# Altium project BP.PrjPcb (part 2 of 2)

## Sheet BPPower Management.SchDoc
size A3; ApprovedBy: UDEMY; CheckedBy: Siz Değerli Öğrenciler; Revision: AA; SheetNumber: 3; SheetTotal: 5; PreparedBy: Mustafa Berk AYDOĞAN; ProjectDescription: Wireless Security
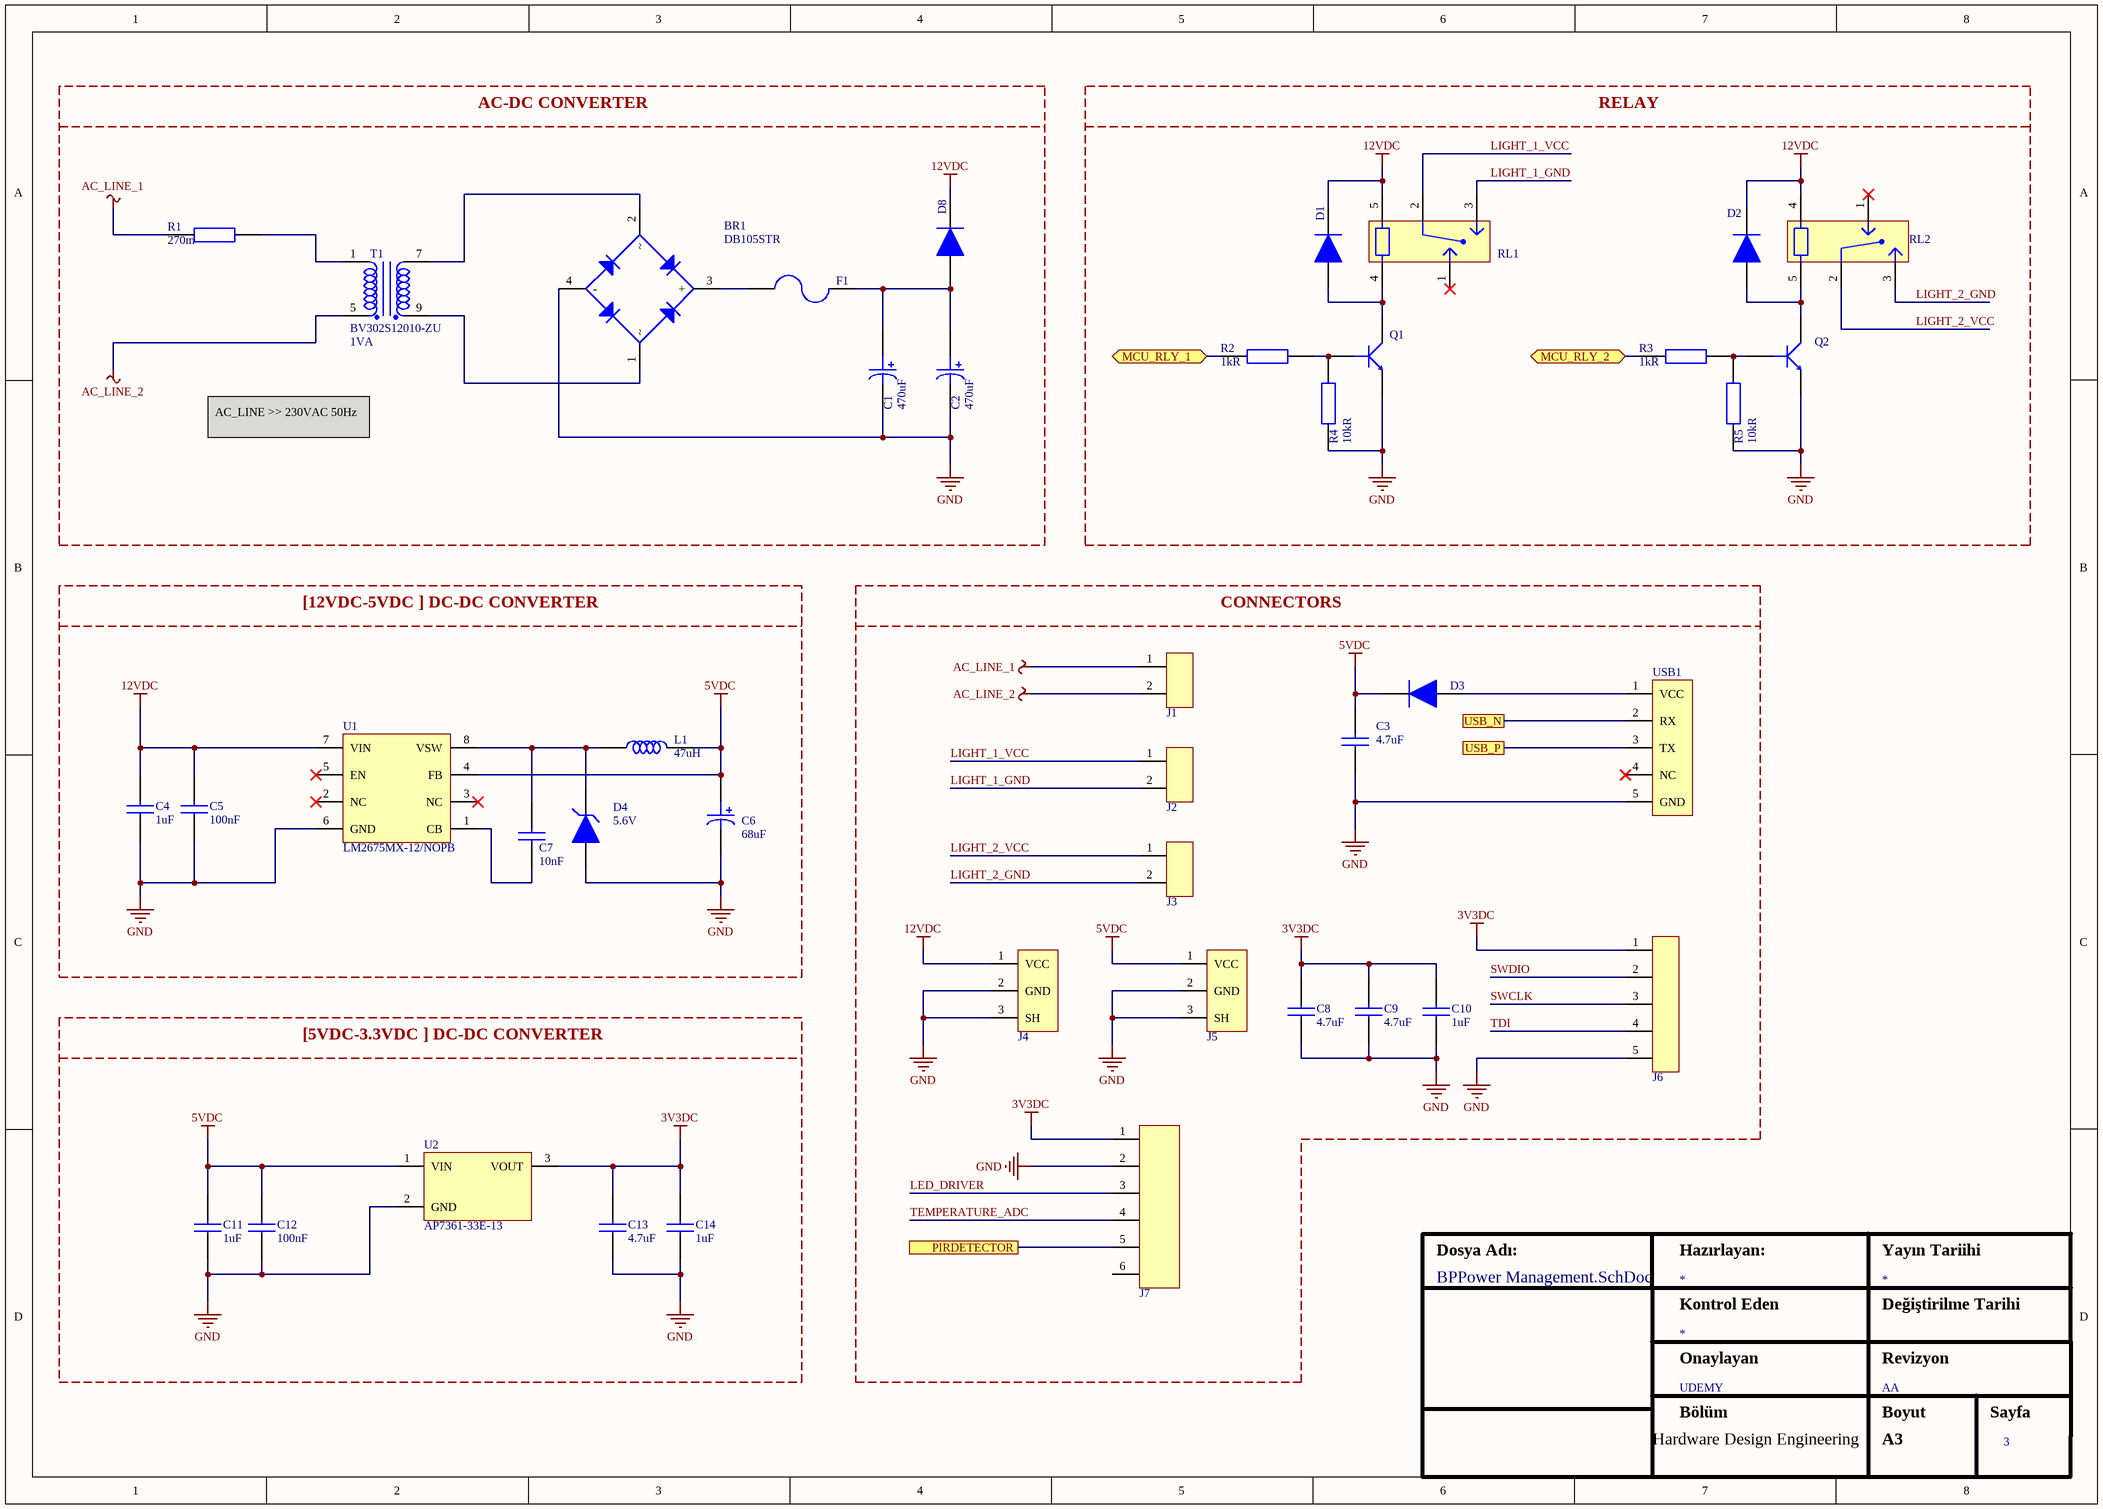
[diagram p1: BPPower Management.SchDoc]

### Parts
BR1  DB105STR  [DB105STR]
C1  Capacitance: 470uF  [CAP_RADIAL_D10_P5]  (hidden comment: ESH477M050AH4AA)
C2  Capacitance: 470uF  [CAP_RADIAL_D10_P5]  (hidden comment: ESH477M050AH4AA)
C3  Capacitance: 4.7uF  [CAP_0805]  (hidden comment: CL21A475KAQNNNE)
C4  Capacitance: 1uF  [CAP_0805]  (hidden comment: CL21B105KBFNNNE)
C5  Capacitance: 100nF  [CAP_0805]  (hidden comment: CL21B104KBCNNNC)
C6  Capacitance: 68uF  [CAP_EEVseries]  (hidden comment: EEV686M035A9HAA)
C7  Capacitance: 10nF  [CAP_0603]  (hidden comment: 0603B103K160CT)
C8  Capacitance: 4.7uF  [CAP_0805]  (hidden comment: CL21A475KAQNNNE)
C9  Capacitance: 4.7uF  [CAP_0805]  (hidden comment: CL21A475KAQNNNE)
C10  Capacitance: 1uF  [CAP_0805]  (hidden comment: CL21B105KBFNNNE)
C11  Capacitance: 1uF  [CAP_0805]  (hidden comment: CL21B105KBFNNNE)
C12  Capacitance: 100nF  [CAP_0603]  (hidden comment: C0603C104K5RACTU)
C13  Capacitance: 4.7uF  [CAP_0805]  (hidden comment: CL21A475KAQNNNE)
C14  Capacitance: 1uF  [CAP_0805]  (hidden comment: CL21B105KBFNNNE)
D1  1N4148WS  [SOD323F]  (value not drawn)
D2  1N4148WS  [SOD323F]  (value not drawn)
D3  1N4148WS  [SOD323F]  (value not drawn)
D4  Working Voltage: 5.6V  [SMB]  (hidden comment: 1SMB5919BT3G)
D8  1N4148WS  [SOD323F]  (value not drawn)
F1  3413.0216.22  [3413.0216.22]  (value not drawn)
J1  TBP01R1-508-02BE  [TBP01R1-508]  (value not drawn)
J2  TBP01R1-508-02BE  [TBP01R1-508]  (value not drawn)
J3  TBP01R1-508-02BE  [TBP01R1-508]  (value not drawn)
J4  PJ-037AH-SMT-TR  [JACK]  (value not drawn)
J5  PJ-037AH-SMT-TR  [JACK]  (value not drawn)
J6  SMH-105-02-L-S  [PINHEADER1X5_RA]  (value not drawn)
J7  64800611622  [64800611622]  (value not drawn)
L1  Inductance: 47uH  [IND_1212]  (hidden comment: 78438335470)
Q1  MMBT3904-7-F  [SOT-23F]  (value not drawn)
Q2  MMBT3904-7-F  [SOT-23F]  (value not drawn)
R1  Resistance: 270m  [RES_AXIAL_W]  (hidden comment: 5WD27)
R2  Resistance: 1kR  [RES_0603]  (hidden comment: RC0603FR-0710KL)
R3  Resistance: 1kR  [RES_0603]  (hidden comment: RC0603FR-0710KL)
R4  Resistance: 10kR  [RES_0603]  (hidden comment: RC0603FR-0710KL)
R5  Resistance: 10kR  [RES_0603]  (hidden comment: RC0603FR-0710KL)
RL1  ALQ112  [ALQ112]  (value not drawn)
RL2  ALQ112  [ALQ112]  (value not drawn)
T1  BV302S12010-ZU  Rated Power: 1VA  [BV302S]
U1  LM2675MX-12/NOPB  [SOIC8]
U2  AP7361-33E-13  [SOT223]
USB1  10118192-0001LF  [MICRO_B_USB]  (value not drawn)

### Blocks framed on the sheet
AC-DC CONVERTER: BR1 C1 C2 D8 F1 R1 T1
RELAY: D1 D2 Q1 Q2 R2-R5 RL1 RL2
[12VDC-5VDC ] DC-DC CONVERTER: C4-C7 D4 L1 U1
CONNECTORS: C3 C8-C10 D3 J1-J7 USB1
[5VDC-3.3VDC ] DC-DC CONVERTER: C11-C14 U2

### Ports
MCU_RLY_1 (bidir), MCU_RLY_2 (bidir), PIRDETECTOR, USB_N, USB_P

### Nets
3V3DC: C8.2 C9.2 C10.2 C13.2 C14.2 J6.1 J7.1 U2.3(VOUT)
5VDC: C3.2 C6.1 C11.2 C12.2 D3.1 J5.1(VCC) L1.2 U1.4(FB) U2.1(VIN)
12VDC: C4.2 C5.2 D1.1 D2.1 D8.1 J4.1(VCC) RL1.5 RL2.4 U1.7(VIN)
AC_LINE_1: J1.1 R1.1
AC_LINE_2: J1.2 T1.5
GND: BR1.4(-) C1.2 C2.2 C3.1 C4.1 C5.1 C6.2 C8.1 C9.1 C10.1 C11.1 C12.1 C13.1 C14.1 D4.A J4.2(GND) J4.3(SH) J5.2(GND) J5.3(SH) J6.5 J7.2 Q1.2(E) Q2.2(E) R4.1 R5.1 U1.6(GND) U2.2(GND) USB1.5(GND)
LED_DRIVER: J7.3
LIGHT_1_GND: J2.2 RL1.3
LIGHT_1_VCC: J2.1 RL1.2
LIGHT_2_GND: J3.2 RL2.3
LIGHT_2_VCC: J3.1 RL2.2
SWCLK: J6.3
SWDIO: J6.2
TDI: J6.4
TEMPERATURE_ADC: J7.4
NetBR1_1: BR1.1 T1.9
NetBR1_2: BR1.2 T1.7
NetBR1_3: BR1.3(+) F1.1
NetC1_1: C1.1 C2.1 D8.2 F1.2
NetC7_1: C7.1 U1.1(CB)
NetC7_2: C7.2 D4.C L1.1 U1.8(VSW)
NetD1_2: D1.2 Q1.3(C) RL1.4
NetD2_2: D2.2 Q2.3(C) RL2.5
NetD3_2: D3.2 USB1.1(VCC)
NetJ7_5: J7.5 ; port PIRDETECTOR
NetQ1_1: Q1.1(B) R2.2 R4.2
NetQ2_1: Q2.1(B) R3.2 R5.2
NetR1_2: R1.2 T1.1
NetR2_1: R2.1 ; port MCU_RLY_1
NetR3_1: R3.1 ; port MCU_RLY_2
NetUSB1_2: USB1.2(RX) ; port USB_N
NetUSB1_3: USB1.3(TX) ; port USB_P

Not connected (* = marked no-connect by the designer): J7 6; RL1 1*; RL2 1*; U1 2(NC)* 3(NC)* 5(EN)*; USB1 4(NC)*

### Notes on the sheet
- AC_LINE >> 230VAC 50Hz
- Dosya Adı:
- Hazırlayan:
- Yayın Tariihi
- Kontrol Eden
- Değiştirilme Tarihi
- Onaylayan
- Revizyon
- Hardware Design Engineering
- Bölüm
- Boyut
- A3
- Sayfa

### Library data of the parts
BR1 = DB105STR: Bridge Diode AC-DC; Manufacturer: Sangdest Microelectronics; Designed by: BERK; Max Current: 1A; Operating Voltage: 600V; Supplier 1: Digi-Key; Manufacturer Part Number: DB105STR; RoHS: No; Supplier Part Number 1: 1655-1821-1-ND
C1 C2 = CAP ALU ELEC 470uF 50V: CAP ALU ELEC 470uF 50V RADIAL; Manufacturer: KEMET; Designed by: BERK; Polarity: Polar; Tolerance: 20%; Life (Hours): 2000Hour; Supplier 1: Digi-Key; Manufacturer Part Number: ESH477M050AH4AA; RoHS: No; Stock 1: 1181; Pricing 1: 1=0,59000, 10=0,41700, 50=0,31540, 100=0,27470, 500=0,20350, 1000=0,17298, 2500=0,16280, 5000=0,15262 (USD); Mount: Through Hole; Case/Package: Radial; Min Operating Temperature: -40°C; Max Operating Temperature: 105°C; Packaging: Bulk; Voltage Rating: 50V; RoHS Compliant: No; ComponentLink1URL: https://api.kemet.com/component-edge/download/datasheet/ESH477M050AH4AA.pdf?src-supplier=Digi-Key; ComponentLink1Description: https://api.kemet.com/component-edge/download/datasheet/ESH477M050AH4AA.pdf?src-supplier=Digi-Key; Supplier Part Number 1: 399-15683-ND
C3 C8 C9 C13 = CAP CER 4.7uF 0805: CAP CER 4.7uF %10 0805; Manufacturer: Samsung; Tolerance: 10%; Voltage Rating: 25V; Dielectric: X5R; Designed by: BERK; Supplier 1: Digi-Key; Manufacturer Part Number: CL21A475KAQNNNE; RoHS: Yes; Category: Ceramic Capacitors; Stock 1: 1477018; Pricing 1: 1=0,11000, 10=0,08100, 50=0,04580, 100=0,03800, 500=0,02664, 1000=0,02205 (USD); Mount: Surface Mount; Case/Package: 0805; Case Code (Metric): 2012; Case Code (Imperial): 0805; Min Operating Temperature: -55°C; Max Operating Temperature: 85°C; Package Quantity: 1; Packaging: Tape and Reel; Voltage Rating (DC): 25V; Series: CL; Construction: Flat; Length: 2mm; Width: 0.049inch; Height: 1.25mm; Thickness: 0.055inch; Depth: 1.25mm; Radiation Hardening: No; Lead Free: Lead Free; RoHS Compliant: Yes; ComponentLink1URL: https://datasheet.ciiva.com/25798/cl21a475kaqnnne-25798882.pdf?src-supplier=Digi-Key; ComponentLink1Description: https://datasheet.ciiva.com/25798/cl21a475kaqnnne-25798882.pdf?src-supplier=Digi-Key; Supplier Part Number 1: 1276-1244-1-ND
C4 C10 C11 C14 = CAP CER 1uF 0805: CAP CER 1uF %10 0805; Manufacturer: Samsung; Designed by: BERK; Tolerance: 10%; Voltage Rating: 50V; Dielectric: X7R; Supplier 1: Digi-Key; Manufacturer Part Number: CL21B105KBFNNNE; RoHS: Yes; Category: Ceramic Capacitors; Stock 1: 958000; Pricing 1: 2000=0,02138, 4000=0,01956 (USD); Mount: Surface Mount; Case/Package: 0805; Case Code (Metric): 2012; Case Code (Imperial): 0805; Min Operating Temperature: -55°C; Max Operating Temperature: 125°C; Packaging: Tape and Reel; Package Quantity: 1; Voltage: 50V; Series: CL; Construction: Flat; Length: 2mm; Width: 0.049inch; Height: 1.25mm; Thickness: 0.053inch; Depth: 1.25mm; Radiation Hardening: No; RoHS Compliant: Yes; ComponentLink1URL: https://datasheet.ciiva.com/25800/cl21b105kbfnnne-25800291.pdf?src-supplier=Digi-Key; ComponentLink1Description: https://datasheet.ciiva.com/25800/cl21b105kbfnnne-25800291.pdf?src-supplier=Digi-Key; ComponentLink2URL: https://datasheet.ciiva.com/16449/cl21b105kbfnnne-16449003.pdf?src-supplier=Future+Electronics; ComponentLink2Description: https://datasheet.ciiva.com/16449/cl21b105kbfnnne-16449003.pdf?src-supplier=Future+Electronics; ComponentLink3URL: https://datasheet.ciiva.com/26838/getdatasheetpartid-354075-26838668.pdf?src-supplier=Verical; ComponentLink3Description: https://datasheet.ciiva.com/26838/getdatasheetpartid-354075-26838668.pdf?src-supplier=Verical; Supplier Part Number 1: 1276-1029-2-ND
C5 = CAP CER 100nF 0805: CAP CER 100nF %10 0805; Manufacturer: Samsung; Designed by: BERK; Material: Ceramic; Tolerance: 10%; Dielectric: X7R; Voltage Rating: 50V; Supplier 1: Digi-Key; Manufacturer Part Number: CL21B104KBCNNNC; RoHS: Yes; Category: Ceramic Capacitors; Stock 1: 3371502; Pricing 1: 1=0,10000, 10=0,04700, 50=0,02560, 100=0,02090, 500=0,01494, 1000=0,01174 (USD); Mount: Surface Mount; Case/Package: 0805; Case Code (Metric): 2012; Case Code (Imperial): 0805; Contact Plating: Tin; Min Operating Temperature: -55°C; Max Operating Temperature: 125°C; Packaging: Tape and Reel; Voltage: 50V; Voltage Rating (DC): 50V; Series: CL; Construction: Flat; Length: 2mm; Width: 0.049inch; Height: 0.85mm; Depth: 1.25mm; Thickness: 0.037inch; Radiation Hardening: No; Lead Free: Lead Free; RoHS Compliant: Yes; ComponentLink1URL: https://datasheet.ciiva.com/25710/cl21b104kbcnnnc-25710182.pdf?src-supplier=Digi-Key; ComponentLink1Description: https://datasheet.ciiva.com/25710/cl21b104kbcnnnc-25710182.pdf?src-supplier=Digi-Key; ComponentLink2URL: https://datasheet.ciiva.com/29199/454152-da-01-en-vs-kondensator-0805-29199814.pdf?src-supplier=Conrad; ComponentLink2Description: https://datasheet.ciiva.com/29199/454152-da-01-en-vs-kondensator-0805-29199814.pdf?src-supplier=Conrad; Supplier Part Number 1: 1276-1003-1-ND
C6 = CAP ALU 68uF: Cap Aluminum Lytic 68uF 35V 20% (6.3 X 7.7mm) SMD 280mA 2000h 105C T/R; Manufacturer: KEMET; Impedance: 340mR; Ripple Current: 196mA; Life (Hours): 2000Hour; Designator by: BERK; Supplier 1: Digi-Key; Manufacturer Part Number: EEV686M035A9HAA; RoHS: Yes; Category: Aluminum Electrolytic Capacitors; Stock 1: 543; Pricing 1: 1=0,54000, 10=0,38000, 50=0,28740, 100=0,25040, 500=0,18546 (USD); Mount: Surface Mount; Case/Package: Radial; Min Operating Temperature: -40°C; Max Operating Temperature: 105°C; Packaging: Tape and Reel; Package Quantity: 1; Voltage Rating: 35V; Tolerance: 20%; Voltage Rating (DC): 35V; Termination: SMD/SMT; Series: EEV; Length: 7.7mm; Height - Seated (Max): 0.315inch; RoHS Compliant: Yes; ComponentLink1URL: https://datasheet.ciiva.com/5365/kem-a4002-eev-535332-5365784.pdf?src-supplier=Mouser; ComponentLink1Description: https://datasheet.ciiva.com/5365/kem-a4002-eev-535332-5365784.pdf?src-supplier=Mouser; Supplier Part Number 1: 399-6722-1-ND
C7 = CAP CER 10nF 0603: CAP CER 10nF %10 0603; Manufacturer: Walsin Technologies; Designed by: BERK; Tolerance: 10%; Dielectric: X7R; Voltage Rating: 16V; Supplier 1: Digi-Key; Manufacturer Part Number: 0603B103K160CT; RoHS: Yes; Category: Ceramic Capacitors; Stock 1: 102474; Pricing 1: 1=0,10000, 10=0,03600, 50=0,01940, 100=0,01590, 500=0,01136, 1000=0,00892 (USD); Case/Package: 0603; Case Code (Metric): 1608; Case Code (Imperial): 0603; Min Operating Temperature: -55°C; Max Operating Temperature: 125°C; Packaging: Tape and Reel; Voltage Rating (DC): 16V; Length: 1.6mm; Depth: 0.8mm; REACH SVHC: Unknown; RoHS Compliant: Yes; ComponentLink1URL: http://www.farnell.com/datasheets/1958513.pdf?src-supplier=Farnell; ComponentLink1Description: http://www.farnell.com/datasheets/1958513.pdf?src-supplier=Farnell; ComponentLink2URL: http://components.arrow.com/part/dataview/0323_00656382?src-supplier=Arrow+Europe; ComponentLink2Description: http://components.arrow.com/part/dataview/0323_00656382?src-supplier=Arrow+Europe; ComponentLink3URL: http://www.farnell.com/datasheets/1958513.pdf?src-supplier=Element14; ComponentLink3Description: http://www.farnell.com/datasheets/1958513.pdf?src-supplier=Element14; ComponentLink4URL: http://www.passivecomponent.com/wp-content/uploads/2018/10/MLCC.pdf?src-supplier=Digi-Key; ComponentLink4Description: http://www.passivecomponent.com/wp-content/uploads/2018/10/MLCC.pdf?src-supplier=Digi-Key; Supplier Part Number 1: 1292-1384-1-ND
C12 = CAP CER 100nF 0603: CAP CER 100nF %10 0603 SMD; Manufacturer: KEMET; Designed by: BERK; Dielectric Material: Ceramic; Voltage Rating (DC): 50V; Tolerance: 10%; Dielectric: X7R; Dissipation Factor: 2.5%; Supplier 1: Digi-Key; Manufacturer Part Number: C0603C104K5RACTU; RoHS: Yes; Category: Ceramic Capacitors; Stock 1: 1666186; Pricing 1: 1=0,12000, 10=0,08500, 50=0,04620, 100=0,03770, 500=0,02696, 1000=0,02118 (USD); Mount: Surface Mount; Case/Package: 0603; Number of Pins: 2; Case Code (Metric): 1608; Case Code (Imperial): 0603; Contact Plating: Tin,Matte; Min Operating Temperature: -55°C; Max Operating Temperature: 125°C; Packaging: Tape and Reel; Package Quantity: 1; Termination: SMD/SMT; Voltage: 50V; Voltage Rating: 50V; Series: SMD Comm X7R; Length: 0.063inch; Width: 0.031inch; Height: 0.8mm; Thickness: 0.034inch; Lead Pitch: 0.7mm; Depth: 0.8mm; Radiation Hardening: No; RoHS Compliant: Yes; REACH SVHC: No SVHC; ComponentLink1URL: https://datasheet.ciiva.com/7823/kem-c1002-x7r-smd-7823591.pdf?src-supplier=Element14; ComponentLink1Description: https://datasheet.ciiva.com/7823/kem-c1002-x7r-smd-7823591.pdf?src-supplier=Element14; ComponentLink2URL: https://datasheet.ciiva.com/14602/70095383-14602583.pdf?src-supplier=Allied+Electronics; ComponentLink2Description: https://datasheet.ciiva.com/14602/70095383-14602583.pdf?src-supplier=Allied+Electronics; ComponentLink3URL: https://datasheet.ciiva.com/5999/kem-c1002-x7r-smd-5999400.pdf?src-supplier=Farnell; ComponentLink3Description: https://datasheet.ciiva.com/5999/kem-c1002-x7r-smd-5999400.pdf?src-supplier=Farnell; ComponentLink4URL: https://datasheet.ciiva.com/7823/kem-c1002-x7r-smd-7823592.pdf?src-supplier=Element14; ComponentLink4Description: https://datasheet.ciiva.com/7823/kem-c1002-x7r-smd-7823592.pdf?src-supplier=Element14; ComponentLink5URL: https://datasheet.ciiva.com/28645/1851736-28645640.pdf?src-supplier=Element14; ComponentLink5Description: https://datasheet.ciiva.com/28645/1851736-28645640.pdf?src-supplier=Element14; ComponentLink6URL: https://datasheet.ciiva.com/14585/70095383-14585209.pdf?src-supplier=Allied+Electronics; ComponentLink6Description: https://datasheet.ciiva.com/14585/70095383-14585209.pdf?src-supplier=Allied+Electronics; Supplier Part Number 1: 399-5089-1-ND
D1-D3 D8 = 1N4148WS: Diode, Single, 75 V, 150 mA, 1 V, 4 ns; Manufacturer: ON Semiconductor / Fairchild; Designed by: BERK; Forward Current: 150mA; Reverse Recovery Time: 4ns; Max Repetitive Reverse Voltage (Vrrm): 75V; Power Dissipation: 200mW; Max Reverse Current: 5uA; Forward Voltage: 1V; Max Forward Surge Current (Ifsm): 2A; Supplier 1: Digi-Key; Manufacturer Part Number: 1N4148WS; RoHS: Yes; Category: Rectifier Diodes; Stock 1: 79118; Pricing 1: 1=0,17000, 10=0,12100, 100=0,06530, 500=0,05128, 1000=0,03562 (USD); Mount: Surface Mount; Number of Pins: 2; Contact Plating: Tin,Matte; Weight: 0.0276g; Min Operating Temperature: -55°C; Max Operating Temperature: 150°C; Packaging: Tape and Reel; Package Quantity: 1; Recovery Time: 4ns; Average Rectified Current: 150mA; Element Configuration: Single; Reverse Voltage: 75V; Max Reverse Voltage (DC): 75V; Series: -; Length: 1.8mm; Width: 1.35mm; Height: 1mm; Radiation Hardening: No; REACH SVHC: No SVHC; Lead Free: Lead Free; RoHS Compliant: Yes; ComponentLink1URL: https://datasheet.ciiva.com/25968/1n914bws-25968945.pdf?src-supplier=Avnet+Europe; ComponentLink1Description: https://datasheet.ciiva.com/25968/1n914bws-25968945.pdf?src-supplier=Avnet+Europe; ComponentLink2URL: https://datasheet.ciiva.com/30479/0900766b810e1cd3-30479206.pdf?src-supplier=RSComponents; ComponentLink2Description: https://datasheet.ciiva.com/30479/0900766b810e1cd3-30479206.pdf?src-supplier=RSComponents; ComponentLink3URL: https://datasheet.ciiva.com/910/1n4148ws-910381.pdf?src-supplier=Digi-Key; ComponentLink3Description: https://datasheet.ciiva.com/910/1n4148ws-910381.pdf?src-supplier=Digi-Key; ComponentLink4URL: https://datasheet.ciiva.com/15208/getdatasheetpartid-127819-15208358.pdf?src-supplier=Verical; ComponentLink4Description: https://datasheet.ciiva.com/15208/getdatasheetpartid-127819-15208358.pdf?src-supplier=Verical; ComponentLink5URL: https://datasheet.ciiva.com/8300/1n914bws-8300360.pdf?src-supplier=Avnet; ComponentLink5Description: https://datasheet.ciiva.com/8300/1n914bws-8300360.pdf?src-supplier=Avnet; ComponentLink6URL: https://datasheet.ciiva.com/910/1n4148ws-910380.pdf?src-supplier=Digi-Key; ComponentLink6Description: https://datasheet.ciiva.com/910/1n4148ws-910380.pdf?src-supplier=Digi-Key; ComponentLink7URL: https://datasheet.ciiva.com/910/1n4148ws-910382.pdf?src-supplier=Digi-Key; ComponentLink7Description: https://datasheet.ciiva.com/910/1n4148ws-910382.pdf?src-supplier=Digi-Key; Supplier Part Number 1: 1N4148WSFSCT-ND
D4 = 1SMB5919BT3G: Diode Zener Single 5.6V 5% 3W 2-Pin SMB T/R; Manufacturer: ON Semiconductor; Designed by: BERK; Material: Plastic; Max Reverse Leakage Current: 5uA; Impedance: 2R; Forward Voltage: 1.5V; Power Dissipation: 550mW; Zener Current: 267mA; Test Current: 66.9mA; Breakdown Voltage: 5.88V; ESD Protection: Yes; Supplier 1: Digi-Key; Manufacturer Part Number: 1SMB5919BT3G; RoHS: Yes; Category: Zener Diodes; Pricing 1: 1=0,45000, 10=0,31900, 100=0,16110, 500=0,14274, 1000=0,11109 (USD); Case/Package: SMB; Number of Pins: 2; Contact Plating: Tin,Matte; Min Operating Temperature: -65°C; Max Operating Temperature: 150°C; Package Quantity: 1; Packaging: Tape and Reel; Max Power Dissipation: 3W; Tolerance: 5%; Voltage Tolerance: 5%; Zener Voltage: 5.6V; Element Configuration: Single; Voltage Rating (DC): 5.6V; Power Rating: 3W; Length: 4.32mm; Width: 3.56mm; Height: 2.13mm; Radiation Hardening: No; Lead Free: Lead Free; Halogen Free: Halogen Free; REACH SVHC: No SVHC; ComponentLink1URL: https://datasheet.ciiva.com/27747/1308331-27747654.pdf?src-supplier=Jameco; ComponentLink1Description: https://datasheet.ciiva.com/27747/1308331-27747654.pdf?src-supplier=Jameco; ComponentLink2URL: https://datasheet.ciiva.com/1182/1smb5913bt3-d-1182657.pdf?src-supplier=Element14; ComponentLink2Description: https://datasheet.ciiva.com/1182/1smb5913bt3-d-1182657.pdf?src-supplier=Element14; ComponentLink3URL: https://datasheet.ciiva.com/1182/1smb5913bt3-d-1182658.pdf?src-supplier=Element14; ComponentLink3Description: https://datasheet.ciiva.com/1182/1smb5913bt3-d-1182658.pdf?src-supplier=Element14; ComponentLink4URL: https://datasheet.ciiva.com/895/1smb5913bt3-d-895203.pdf?src-supplier=Digi-Key; ComponentLink4Description: https://datasheet.ciiva.com/895/1smb5913bt3-d-895203.pdf?src-supplier=Digi-Key; ComponentLink5URL: https://datasheet.ciiva.com/895/1smb5913bt3-d-895204.pdf?src-supplier=Digi-Key; ComponentLink5Description: https://datasheet.ciiva.com/895/1smb5913bt3-d-895204.pdf?src-supplier=Digi-Key; ComponentLink6URL: https://datasheet.ciiva.com/895/1smb5913bt3-d-895205.pdf?src-supplier=Digi-Key; ComponentLink6Description: https://datasheet.ciiva.com/895/1smb5913bt3-d-895205.pdf?src-supplier=Digi-Key; ComponentLink7URL: https://datasheet.ciiva.com/15198/getdatasheetpartid-311040-15198695.pdf?src-supplier=Verical; ComponentLink7Description: https://datasheet.ciiva.com/15198/getdatasheetpartid-311040-15198695.pdf?src-supplier=Verical; ComponentLink8URL: https://datasheet.ciiva.com/16311/1smb5913bt3-d-16311847.pdf?src-supplier=Future+Electronics; ComponentLink8Description: https://datasheet.ciiva.com/16311/1smb5913bt3-d-16311847.pdf?src-supplier=Future+Electronics; ComponentLink9URL: https://datasheet.ciiva.com/16472/1smb5913bt3-d-16472779.pdf?src-supplier=Avnet+Asia; ComponentLink9Description: https://datasheet.ciiva.com/16472/1smb5913bt3-d-16472779.pdf?src-supplier=Avnet+Asia; Max Reverse Current: 5uA; Supplier Part Number 1: 1SMB5919BT3GOSCT-ND
F1 = FUSE 3413.0216.22: FUSE BRD MNT 1A 32VAC 63VDC 1206; Manufacturer: Schurter; Body Material: Glass,Epoxy; Max Voltage Rating (DC): 63V; Voltage Rating (AC): 32V; DC Cold Resistance: 94.2mR; Fuse Type: Board Mount (Cartridge Style Excluded); Approvals: VDE,cURus; Designed by: BERK; Supplier 1: Digi-Key; Manufacturer Part Number: 3413.0216.22; RoHS: Yes; Category: Fuses; Stock 1: 609; Pricing 1: 1=0,67000, 50=0,52400, 100=0,39700, 500=0,31100 (USD); Mount: Surface Mount,PCB; Case/Package: 1206; Number of Pins: 2; Weight: 0.000212oz; Case Code (Metric): 3216; Case Code (Imperial): 1206; Contact Plating: Gold; Housing Material: Glass; Terminal Material: Tin; Min Operating Temperature: -55°C; Max Operating Temperature: 90°C; Current Rating: 1A; Package Quantity: 1000; Voltage Rating (DC): 63V; Packaging: Tape and Reel; Max Voltage Rating (AC): 32V; Voltage Rating: 32V; Termination: SMD/SMT; Working Voltage: 32V; Series: USI 1206; Length: 3.2mm; Width: 1.6mm; Height: 0.6mm; Depth: 1.6mm; Radiation Hardening: No; Lead Free: Lead Free; RoHS Compliant: Yes; ComponentLink1URL: https://datasheet.ciiva.com/301/typ-usi-1206-301440.pdf?src-supplier=Digi-Key; ComponentLink1Description: https://datasheet.ciiva.com/301/typ-usi-1206-301440.pdf?src-supplier=Digi-Key; ComponentLink2URL: https://datasheet.ciiva.com/14541/70160006-14541114.pdf?src-supplier=Allied+Electronics; ComponentLink2Description: https://datasheet.ciiva.com/14541/70160006-14541114.pdf?src-supplier=Allied+Electronics; ComponentLink3URL: https://datasheet.ciiva.com/301/typ-usi-1206-301439.pdf?src-supplier=Digi-Key; ComponentLink3Description: https://datasheet.ciiva.com/301/typ-usi-1206-301439.pdf?src-supplier=Digi-Key; ComponentLink4URL: https://datasheet.ciiva.com/301/typ-usi-1206-301441.pdf?src-supplier=Digi-Key; ComponentLink4Description: https://datasheet.ciiva.com/301/typ-usi-1206-301441.pdf?src-supplier=Digi-Key; ComponentLink5URL: https://datasheet.ciiva.com/8264/typ-usi-1206-8264583.pdf?src-supplier=Avnet; ComponentLink5Description: https://datasheet.ciiva.com/8264/typ-usi-1206-8264583.pdf?src-supplier=Avnet; ComponentLink6URL: https://datasheet.ciiva.com/14102/qousi1206-data-e-14102903.pdf?src-supplier=Distrelec; ComponentLink6Description: https://datasheet.ciiva.com/14102/qousi1206-data-e-14102903.pdf?src-supplier=Distrelec; ComponentLink7URL: https://datasheet.ciiva.com/17405/typ-usi-1206-17405433.pdf?src-supplier=Avnet+Europe; ComponentLink7Description: https://datasheet.ciiva.com/17405/typ-usi-1206-17405433.pdf?src-supplier=Avnet+Europe; ComponentLink8URL: https://datasheet.ciiva.com/16316/typ-usi-1206-16316588.pdf?src-supplier=Future+Electronics; ComponentLink8Description: https://datasheet.ciiva.com/16316/typ-usi-1206-16316588.pdf?src-supplier=Future+Electronics; Supplier Part Number 1: 486-1144-1-ND
J1-J3 = TBP01R1-508-02BE: Conn Shrouded Header HDR 2 POS 5.08mm Solder RA Side Entry Thru-Hole Bag; Manufacturer: CUI; Designed by: BERK; Supplier 1: Digi-Key; Manufacturer Part Number: TBP01R1-508-02BE; RoHS: No; Stock 1: 3398; Pricing 1: 1=0,50000, 10=0,26500, 25=0,18760, 50=0,15960, 100=0,15400, 250=0,13020, 500=0,12040, 1000=0,10640, 5000=0,08120 (USD); Supplier Part Number 1: 102-6406-ND
J4 J5 = PJ-037AH-SMT-TR: DC Power Connectors Power Jacks; Manufacturer: CUI; Designed by: BERK; Number of Conductors: 2; Gender: Male; Shielding: Unshielded; Current Rating: 5A; Voltage Rating: 24V; Insulation Resistance: 100MR; Supplier 1: Digi-Key; Manufacturer Part Number: PJ-037AH-SMT-TR; RoHS: Yes; Category: Connectors; Stock 1: 4972; Pricing 1: 1=1,36000, 10=1,19300, 25=1,12320, 50=1,07640, 100=1,02960 (USD); Mount: Surface Mount,Through Hole; Case/Package: SMD/SMT; Color: Black; Contact Material: Copper; Contact Plating: Nickel; Housing Color: Black; Housing Material: Thermoplastic; Min Operating Temperature: -25°C; Max Operating Temperature: 85°C; Orientation: Horizontal; Package Quantity: 200; Termination: Solder; Connector Type: Jack; Contact Gender: Male; Packaging: Tape and Reel; Flammability Rating: UL94 V-0; ComponentLink1URL: http://www.mouser.com/ds/2/670/pj-037ah-smt-516065.pdf?src-supplier=Mouser; ComponentLink1Description: http://www.mouser.com/ds/2/670/pj-037ah-smt-516065.pdf?src-supplier=Mouser; ComponentLink2URL: https://www.cui.com/product/resource/digikeypdf/pj-037ah-smt-tr.pdf?src-supplier=Digi-Key; ComponentLink2Description: https://www.cui.com/product/resource/digikeypdf/pj-037ah-smt-tr.pdf?src-supplier=Digi-Key; ComponentLink3URL: http://www.cui.com/product/resource/digikeypdf/pj-037ah-smt.pdf?src-supplier=Digi-Key; ComponentLink3Description: http://www.cui.com/product/resource/digikeypdf/pj-037ah-smt.pdf?src-supplier=Digi-Key; Supplier Part Number 1: CP-037AHPJCT-ND
J6 = SMH-105-02-L-S: .100 C.L. HORIZONTAL SMT SOCKET; Manufacturer: Samtec; Designed by: BERK; Number of Contacts: 4; Gender: Receptacle; Contact Resistance: 10mR; Pitch: 2.54mm; Supplier 1: Digi-Key; Manufacturer Part Number: SMH-105-02-L-S; RoHS: Yes; Category: Headers and Wire Housings; Stock 1: 59; Pricing 1: 1=1,40000, 10=1,27400, 100=1,09200, 500=0,91000, 1000=0,78000, 5000=0,69160, 10000=0,67600 (USD); Contact Plating: Gold; Contact Material: Bronze; Housing Color: Black; Housing Material: Polymer; Min Operating Temperature: -55°C; Max Operating Temperature: 125°C; Number of Rows: 1; Termination: Solder; Packaging: Rail/Tube; Orientation: Horizontal; Length: 13.21mm; Depth: 10.8mm; Radiation Hardening: No; REACH SVHC: No SVHC; ComponentLink1URL: http://components.arrow.com/part/dataview/0323_04802604?src-supplier=Arrow+Europe; ComponentLink1Description: http://components.arrow.com/part/dataview/0323_04802604?src-supplier=Arrow+Europe; ComponentLink2URL: http://www.farnell.com/datasheets/1927708.pdf?_ga=2.237598468.569325269.1503285096-1413671594.1503025027&src-supplier=Farnell; ComponentLink2Description: http://www.farnell.com/datasheets/1927708.pdf?_ga=2.237598468.569325269.1503285096-1413671594.1503025027&src-supplier=Farnell; ComponentLink3URL: ftp://ftp.samtec.com/webfiles/PDF/SMH.PDF?src-supplier=Avnet+Europe; ComponentLink3Description: ftp://ftp.samtec.com/webfiles/PDF/SMH.PDF?src-supplier=Avnet+Europe; ComponentLink4URL: http://www.samtec.com/documents/webfiles/pdf/SMH.PDF?src-supplier=Newark; ComponentLink4Description: http://www.samtec.com/documents/webfiles/pdf/SMH.PDF?src-supplier=Newark; ComponentLink5URL: http://www.samtec.com/documents/webfiles/pdf/SMH.PDF?src-supplier=Avnet; ComponentLink5Description: http://www.samtec.com/documents/webfiles/pdf/SMH.PDF?src-supplier=Avnet; ComponentLink6URL: http://suddendocs.samtec.com/catalog_english/smh.pdf?src-supplier=Digi-Key; ComponentLink6Description: http://suddendocs.samtec.com/catalog_english/smh.pdf?src-supplier=Digi-Key; Supplier Part Number 1: SAM11813-ND
J7 = 64800611622_conn_6pin: 1.50mm 6PIN Connector; Manufacturer: Wurth Electronics; Supplier 1: RSComponents; Manufacturer Part Number: 64800611622; RoHS: No; Stock 1: 100; Pricing 1: 1000=0,29900, 2000=0,28200 (GBP); Supplier Part Number 1: 2138726
L1 = IND 47uH: FIXED IND 47UH 390MA 2.3 OHM SMD; Manufacturer: Wurth Electronics; Core Material: Ferrite; Saturation Current: 1.18A; Shielding: Shielded; DC Resistance (DCR): 2.3R; Self Resonant Frequency: 8MHz; Test Frequency: 100kHz; Tolerance: 30%; Designed by: BERK; Supplier 1: Digi-Key; Manufacturer Part Number: 78438335470; RoHS: No; Category: Fixed Inductors; Stock 1: 885; Pricing 1: 1=1,98000, 50=1,84800, 250=1,69100, 500=1,56800 (USD); Mount: Surface Mount; Case/Package: 1212; Case Code (Metric): 3030; Case Code (Imperial): 1212; Min Operating Temperature: -40°C; Max Operating Temperature: 125°C; Packaging: Tape and Reel; Resistor Type: Wirewound; Current Rating: 390mA; Length: 0.118inch; Width: 0.118inch; Height - Seated (Max): 0.059inch; Ratings: AEC-Q200; RoHS Compliant: No; ComponentLink1URL: https://media.digikey.com/pdf/Data%20Sheets/Wurth%20Electronics%20PDFs/Q+_Products_Flyer.pdf?src-supplier=Digi-Key; ComponentLink1Description: https://media.digikey.com/pdf/Data%20Sheets/Wurth%20Electronics%20PDFs/Q+_Products_Flyer.pdf?src-supplier=Digi-Key; Supplier Part Number 1: 732-6947-1-ND
Q1 Q2 = MMBT3904-7-F: Transistor General Purpose BJT NPN 40 Volt 0.2A Automotive 3-Pin SOT-23; Manufacturer: Diodes Zetex; Designed by: BERK; Max Power Dissipation: 300mW; Collector Emitter Voltage (VCEO): 40V; Max Collector Current: 200mA; Collector Base Voltage (VCBO): 60V; Frequency: 300MHz; hFE Min: 100; Number of Elements: 1; Emitter Base Voltage (VEBO): 6V; Collector Emitter Saturation Voltage: 300mV; Power Dissipation: 350mW; Element Configuration: Single; Supplier 1: Digi-Key; Manufacturer Part Number: MMBT3904-7-F; RoHS: Yes; Category: BJTs; Stock 1: 2393281; Pricing 1: 1=0,12000, 10=0,08600, 25=0,08280, 100=0,04660, 500=0,03664, 1000=0,02544 (USD); Mount: Surface Mount; Case/Package: SOT-23; Number of Pins: 3; Weight: 0.000282oz; Contact Plating: Tin,Matte; Min Operating Temperature: -55°C; Max Operating Temperature: 150°C; Polarity: NPN; Packaging: Tape and Reel; Package Quantity: 3000; Transition Frequency: 300MHz; Collector Emitter Breakdown Voltage: 40V; Max Breakdown Voltage: 40V; Continuous Collector Current: 200mA; Max Frequency: 300MHz; Gain Bandwidth Product: 300MHz; Series: -; Collector-emitter Voltage-Max: 300mV; Voltage Rating (DC): 40V; Length: 3.05mm; Width: 1.4mm; Height: 1mm; Radiation Hardening: No; REACH SVHC: No SVHC; Lead Free: Lead Free; RoHS Compliant: Yes; ComponentLink1URL: https://datasheet.ciiva.com/11201/ds30036-11201778.pdf?src-supplier=Avnet; ComponentLink1Description: https://datasheet.ciiva.com/11201/ds30036-11201778.pdf?src-supplier=Avnet; ComponentLink2URL: https://datasheet.ciiva.com/15138/getdatasheetpartid-53265-15138780.pdf?src-supplier=Verical; ComponentLink2Description: https://datasheet.ciiva.com/15138/getdatasheetpartid-53265-15138780.pdf?src-supplier=Verical; ComponentLink3URL: https://datasheet.ciiva.com/6361/ds30036-6361254.pdf?src-supplier=Digi-Key; ComponentLink3Description: https://datasheet.ciiva.com/6361/ds30036-6361254.pdf?src-supplier=Digi-Key; ComponentLink4URL: https://datasheet.ciiva.com/22711/1915516-22711750.pdf?src-supplier=Element14; ComponentLink4Description: https://datasheet.ciiva.com/22711/1915516-22711750.pdf?src-supplier=Element14; ComponentLink5URL: https://datasheet.ciiva.com/11198/ds30036-11198999.pdf?src-supplier=Avnet; ComponentLink5Description: https://datasheet.ciiva.com/11198/ds30036-11198999.pdf?src-supplier=Avnet; ComponentLink6URL: https://datasheet.ciiva.com/6361/ds30036-6361256.pdf?src-supplier=Digi-Key; ComponentLink6Description: https://datasheet.ciiva.com/6361/ds30036-6361256.pdf?src-supplier=Digi-Key; Supplier Part Number 1: MMBT3904-FDIDKR-ND
R1 = 5WD27: Resistor 5 Watt Cermet Wirewound Flameproof .27 Ohm 5% Axial Lead; Manufacturer: NTE Electronics; Designed by: BERK; Power Rating: 5W; Temperature Coefficient: 300ppm/°C; Supplier 1: Newark; Manufacturer Part Number: 5WD27; Category: Through-Hole Resistors; Pricing 1: 1=0,47600 (USD); Mount: Through Hole; Case/Package: Axial; Min Operating Temperature: -55°C; Max Operating Temperature: 155°C; Tolerance: 5%; Termination: Axial; RoHS Compliant: No; ComponentLink1URL: https://datasheet.ciiva.com/15772/fivewire-15772442.pdf?src-supplier=Onlinecomponents.com; ComponentLink1Description: https://datasheet.ciiva.com/15772/fivewire-15772442.pdf?src-supplier=Onlinecomponents.com; ComponentLink2URL: http://datasheet.octopart.com/5WD27-NTE-Electronics-datasheet-137435208.pdf?src-supplier=NTE+Electronics; ComponentLink2Description: http://datasheet.octopart.com/5WD27-NTE-Electronics-datasheet-137435208.pdf?src-supplier=NTE+Electronics; ComponentLink3URL: http://datasheet.octopart.com/5WD27-NTE-Electronics-datasheet-21210163.pdf?src-supplier=Master+Electronics; ComponentLink3Description: http://datasheet.octopart.com/5WD27-NTE-Electronics-datasheet-21210163.pdf?src-supplier=Master+Electronics; Supplier Part Number 1: 33C8814
R2 R3 = RES 1K OHM 0603: RES 1K %1 OHM 0603 SMD; Manufacturer: Yageo; Manufacturer Part Number: RC0603JR-071KL; Designed by: BERK; Tolerance: 5%; Temperature Coefficient: 100ppm/°C; Voltage Rating (DC): 50V; Power Rating: 100mW; Body Length: 1.6mm; Supplier 1: Digi-Key; RoHS: Yes; Category: Chip SMD Resistors; Stock 1: 5112056; Pricing 1: 1=0,10000, 10=0,01900, 100=0,00770, 1000=0,00344, 2500=0,00298 (USD); Case/Package: 0603; Number of Pins: 2; Contact Plating: Tin,Matte; Case Code (Imperial): 0603; Case Code (Metric): 1608; Size Code: 0603; Min Operating Temperature: -55°C; Max Operating Temperature: 155°C; Resistor Type: Thick Film; Packaging: Tape and Reel; Package Quantity: 5000; Voltage Rating: 50V; Termination: SMD/SMT; Series: RC; Resistance Tolerance: 5%; Construction: Rectangular; Length: 1.6mm; Width: 0.8mm; Height: 0.45mm; Depth: 0.8mm; Radiation Hardening: No; REACH SVHC: Unknown; Lead Free: Lead Free; Military Standard: Not; RoHS Compliant: Yes; ComponentLink1URL: https://datasheet.ciiva.com/8883/pyu-rc0603-51-rohs-l-4-8883051.pdf?src-supplier=Avnet; ComponentLink1Description: https://datasheet.ciiva.com/8883/pyu-rc0603-51-rohs-l-4-8883051.pdf?src-supplier=Avnet; ComponentLink2URL: https://datasheet.ciiva.com/7746/443971-7746461.pdf?src-supplier=Element14; ComponentLink2Description: https://datasheet.ciiva.com/7746/443971-7746461.pdf?src-supplier=Element14; ComponentLink3URL: https://datasheet.ciiva.com/22747/443971-22747533.pdf?src-supplier=Element14; ComponentLink3Description: https://datasheet.ciiva.com/22747/443971-22747533.pdf?src-supplier=Element14; ComponentLink4URL: https://datasheet.ciiva.com/7746/443971-7746462.pdf?src-supplier=Element14; ComponentLink4Description: https://datasheet.ciiva.com/7746/443971-7746462.pdf?src-supplier=Element14; Supplier Part Number 1: 311-1.0KGRCT-ND
R4 R5 = RES 10K OHM 0603: RES 10K %1 OHM 0603 SMD; Manufacturer: Yageo; Designed by: BERK; Tolerance: 1%; Temperature Coefficient: 100ppm/°C; Voltage Rating (DC): 50V; Power Rating: 100mW; Voltage Rating: 75V; Supplier 1: Digi-Key; Manufacturer Part Number: RC0603FR-0710KL; RoHS: Yes; Category: Chip SMD Resistors; Stock 1: 24140601; Pricing 1: 1=0,10000, 10=0,02300, 100=0,00930, 1000=0,00417, 2500=0,00362 (USD); Case/Package: 0603; Number of Pins: 2; Case Code (Imperial): 0603; Case Code (Metric): 1608; Weight: 7.1E-05oz; Size Code: 0603; Min Operating Temperature: -55°C; Max Operating Temperature: 155°C; Resistor Type: Thick Film; Packaging: Tape and Reel; Termination: SMD/SMT; Features: Moisture Resistant; Series: RC; Max Power Dissipation: 100mW; Number of Terminations: 2; Resistance Tolerance: 1%; Construction: Rectangular; Length: 1.6mm; Width: 0.8mm; Height: 0.45mm; Depth: 0.8mm; Lead Pitch: 0.3mm; REACH SVHC: Unknown; Lead Free: Lead Free; Military Standard: Not; RoHS Compliant: Yes; ComponentLink1URL: https://datasheet.ciiva.com/7660/38590-7660789.pdf?src-supplier=Element14; ComponentLink1Description: https://datasheet.ciiva.com/7660/38590-7660789.pdf?src-supplier=Element14; ComponentLink2URL: https://datasheet.ciiva.com/15189/getdatasheetpartid-409289-15189591.pdf?src-supplier=Verical; ComponentLink2Description: https://datasheet.ciiva.com/15189/getdatasheetpartid-409289-15189591.pdf?src-supplier=Verical; ComponentLink3URL: https://datasheet.ciiva.com/46440/1868787-46440891.pdf?src-supplier=Element14; ComponentLink3Description: https://datasheet.ciiva.com/46440/1868787-46440891.pdf?src-supplier=Element14; ComponentLink4URL: https://datasheet.ciiva.com/7983/443971-7983596.pdf?src-supplier=Element14; ComponentLink4Description: https://datasheet.ciiva.com/7983/443971-7983596.pdf?src-supplier=Element14; ComponentLink5URL: https://datasheet.ciiva.com/7746/1738695-7746239.pdf?src-supplier=Element14; ComponentLink5Description: https://datasheet.ciiva.com/7746/1738695-7746239.pdf?src-supplier=Element14; ComponentLink6URL: https://datasheet.ciiva.com/22747/443971-22747519.pdf?src-supplier=Element14; ComponentLink6Description: https://datasheet.ciiva.com/22747/443971-22747519.pdf?src-supplier=Element14; Supplier Part Number 1: 311-10.0KHRCT-ND
RL1 RL2 = ALQ112: General Purpose Relay SPDT (1 Form C) 12VDC Coil Through Hole; Manufacturer: Panasonic; Designed by: BERK; Contact Current Rating: 10A; Voltage Rating (AC): 250V; Power Rating: 400mW; Coil Resistance: 360R; Coil Current: 33.3mA; Operate Time: 20ms; Coil Voltage (DC): 12V; Coil Type: Non-Latching; Supplier 1: Digi-Key; Manufacturer Part Number: ALQ112; RoHS: Yes; Category: Power Relays; Stock 1: 10772; Pricing 1: 1=1,22000, 10=1,14800, 25=1,02000, 50=0,96900, 100=0,91800, 250=0,81600, 500=0,76500, 1000=0,71400, 5000=0,68850 (USD); Number of Pins: 5; Contact Material: Silver; Weight: 7g; Min Operating Temperature: -40°C; Max Operating Temperature: 85°C; Package Quantity: 100; Packaging: Carton; Power Consumption: 400mW; Throw Configuration: SPDT; Termination: PC Pin; Release Time: 20ms; Coil Power: 400mW; Max Voltage Rating (AC): 250V; Relay Type: General Purpose; Series: ALQ; Length: 20mm; Width: 10mm; Height: 16mm; Depth: 10mm; REACH SVHC: Unknown; Lead Free: Lead Free; RoHS Compliant: Yes; ComponentLink1URL: https://datasheet.ciiva.com/24388/307ds-61b20-en-lq-24388909.pdf?src-supplier=Onlinecomponents.com; ComponentLink1Description: https://datasheet.ciiva.com/24388/307ds-61b20-en-lq-24388909.pdf?src-supplier=Onlinecomponents.com; Supplier Part Number 1: 255-3562-ND; Case/Package: ALQ112
T1 = BV302S12010-ZU: 230-12 Transformer 1VA; Manufacturer: Zettler Magnetics; Designed by: BERK; Primary Voltage: 230V; Secondary Voltage: 12V; Operating Frequency: 50-60Hz; Supplier 1: Digi-Key; Manufacturer Part Number: BV302S12010-ZU; RoHS: No; Supplier Part Number 1: 2469-BV302S12010-ZU-ND
U1 = LM2675MX-12/NOPB: Switching Voltage Regulators Pwr Cnvtr Hi Eff 1A SD Vtg Reg; Manufacturer: TI National Semiconductor; Designed by: BERK; Number of Outputs: 1; Output Voltage: 12V; Min Input Voltage: 8V; Max Input Voltage: 40V; Efficiency: 94%; Switching Frequency: 260kHz; Synchronous Rectifier: No; Quiescent Current: 2.5mA; Output Type: Fixed; Supplier 1: Digi-Key; Manufacturer Part Number: LM2675MX-12/NOPB; RoHS: Yes; Category: Voltage Regulators - Switching; Stock 1: 1475; Pricing 1: 1=4,49000, 10=4,03600, 25=3,81600, 100=3,13760, 250=2,81536, 500=2,71360, 1000=2,25568 (USD); Mount: Surface Mount; Case/Package: SOIC N; Number of Pins: 8; Contact Plating: Tin; Min Operating Temperature: -40°C; Max Operating Temperature: 125°C; Max Output Current: 1A; Operating Supply Voltage: 40V; Output Current: 1A; Packaging: Tape and Reel; Package Quantity: 2500; Series: LM2675; Radiation Hardening: No; Lead Free: Lead Free; RoHS Compliant: Yes; ComponentLink1URL: https://datasheet.ciiva.com/41457/001013881-da-01-en-ic-reg-buck-lm2675mx-12-nopb-soic-8-tid-41457896.pdf?src-supplier=Conrad; ComponentLink1Description: https://datasheet.ciiva.com/41457/001013881-da-01-en-ic-reg-buck-lm2675mx-12-nopb-soic-8-tid-41457896.pdf?src-supplier=Conrad; ComponentLink2URL: https://datasheet.ciiva.com/3220/lm2675-3220840.pdf?src-supplier=Avnet; ComponentLink2Description: https://datasheet.ciiva.com/3220/lm2675-3220840.pdf?src-supplier=Avnet; Supplier Part Number 1: 296-35410-1-ND
U2 = AP7361-33E-13: LDO Regulator Pos 3.3V 1A 4-Pin(3+Tab) SOT-223 T/R; Manufacturer: Diodes; Designed by: BERK; Number of Outputs: 1; Min Input Voltage: 2.2V; Max Input Voltage: 6V; Max Power Dissipation: 1.1W; Dropout Voltage: 500mV; Min Current Limit: 1.1A; Polarity: Positive; Quiescent Current: 70uA; Power Dissipation: 1.1kW; Accuracy: 1%; Power Supply Rejection Ratio (PSRR): 65dB; Reference Voltage: 800mV; Output Type: Fixed; Supplier 1: Digi-Key; Manufacturer Part Number: AP7361-33E-13; RoHS: Yes; Category: Voltage Regulators - Linear; Stock 1: 45122; Pricing 1: 1=0,51000, 10=0,41400, 25=0,37840, 100=0,25510, 250=0,21116, 500=0,19356, 1000=0,14517 (USD); Mount: Surface Mount; Case/Package: SOT-223; Number of Pins: 4; Weight: 0.000282oz; Contact Plating: Tin,Matte; Min Operating Temperature: -40°C; Max Operating Temperature: 85°C; Max Output Current: 1A; Output Voltage: 3.3V; Package Quantity: 1; Packaging: Tape and Reel; Output Current: 1A; Number of Regulators: 1; Series: -; Radiation Hardening: No; REACH SVHC: No SVHC; Lead Free: Lead Free; RoHS Compliant: Yes; ComponentLink1URL: https://datasheet.ciiva.com/26926/getdatasheetpartid-670786-26926141.pdf?src-supplier=Verical; ComponentLink1Description: https://datasheet.ciiva.com/26926/getdatasheetpartid-670786-26926141.pdf?src-supplier=Verical; ComponentLink2URL: https://datasheet.ciiva.com/25651/ap7361-25651049.pdf?src-supplier=Digi-Key; ComponentLink2Description: https://datasheet.ciiva.com/25651/ap7361-25651049.pdf?src-supplier=Digi-Key; ComponentLink3URL: https://datasheet.ciiva.com/29568/ap7361-29568378.pdf?src-supplier=Digi-Key; ComponentLink3Description: https://datasheet.ciiva.com/29568/ap7361-29568378.pdf?src-supplier=Digi-Key; ComponentLink4URL: https://datasheet.ciiva.com/29568/ap7361-29568379.pdf?src-supplier=Digi-Key; ComponentLink4Description: https://datasheet.ciiva.com/29568/ap7361-29568379.pdf?src-supplier=Digi-Key; Supplier Part Number 1: AP7361-33E-13DICT-ND
USB1 = Micro B USB Connector: CONN RCPT USB2.0 MICRO B SMD R/A; Manufacturer: Amphenol FCI; Designed by: BERK; Number of Terminals/Pins: 5; Gender: Receptacle; Current Rating: 1.8A; Connector Type: USB,Receptacle; Number of Ports: 1; Insulation Resistance: 1GR; Max Voltage Rating (AC): 100V; Pitch: 0.65mm; Supplier 1: Digi-Key; Manufacturer Part Number: 10118192-0001LF; RoHS: Yes; Category: USB Connectors; Stock 1: 158200; Pricing 1: 1400=0,22558, 2800=0,20624, 7000=0,19335, 9800=0,18046, 14000=0,17402, 35000=0,17144 (USD); Mount: Surface Mount,Horizontal; Contact Plating: Gold; Contact Material: Copper Alloy; Color: Black; Housing Material: Polymer; Min Operating Temperature: -55°C; Max Operating Temperature: 85°C; Termination: Solder; Packaging: Tape and Reel; Number of Contacts: 5; Orientation: Right Angle; Package Quantity: 1400; Features: Shielded; Voltage Rating: 100V; USB Standard: USB 2.0; Length: 7.86mm; Depth: 5.57mm; Radiation Hardening: No; Flammability Rating: UL94 V-0; Lead Free: Lead Free; REACH SVHC: No SVHC; ComponentLink1URL: https://datasheet.ciiva.com/26853/getdatasheetpartid-418041-26853891.pdf?src-supplier=Verical; ComponentLink1Description: https://datasheet.ciiva.com/26853/getdatasheetpartid-418041-26853891.pdf?src-supplier=Verical; ComponentLink2URL: https://datasheet.ciiva.com/851/10118192-851112.pdf?src-supplier=Digi-Key; ComponentLink2Description: https://datasheet.ciiva.com/851/10118192-851112.pdf?src-supplier=Digi-Key; ComponentLink3URL: https://datasheet.ciiva.com/4598/10118192ac-197249-4598796.pdf?src-supplier=Mouser; ComponentLink3Description: https://datasheet.ciiva.com/4598/10118192ac-197249-4598796.pdf?src-supplier=Mouser; Supplier Part Number 1: 609-4613-2-ND

## Assembly variants
12V_Adaptor_Girisle: not fitted BR1 C1 C2 D8 F1 J1 R1 T1
220V_Sebeke_Girisli: all parts fitted